# Altium schematic sheet Power_Circuitry.SchDoc
size A4; SheetNumber: 7; SheetTotal: 7
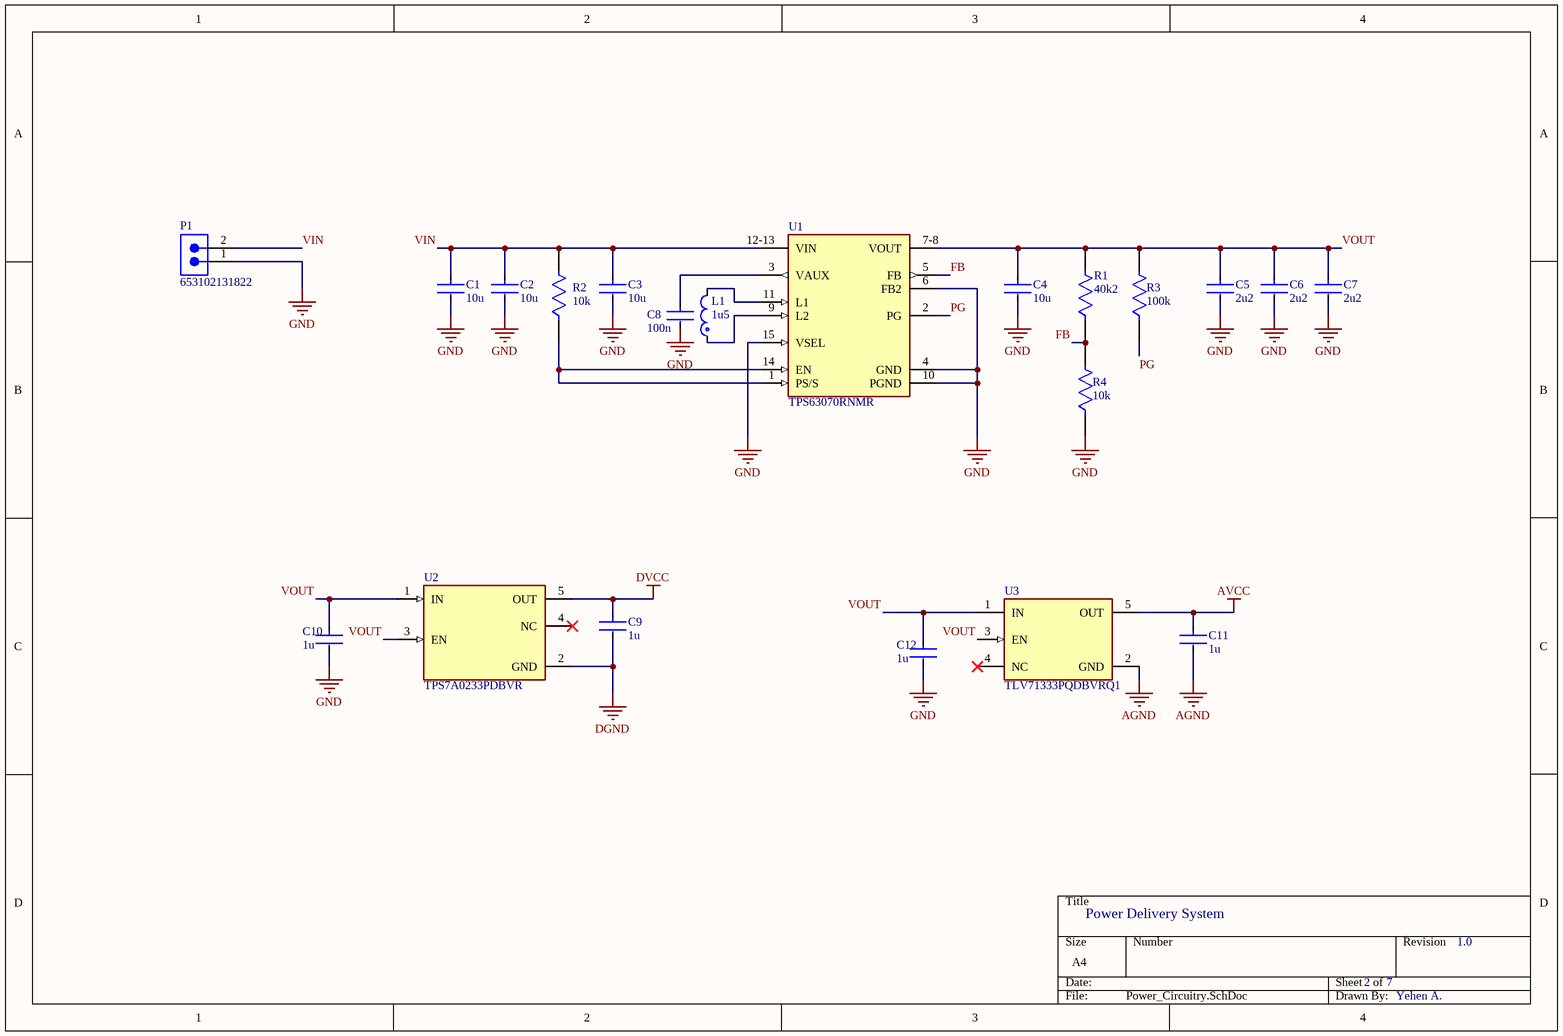
[diagram p0: Power_Circuitry.SchDoc]

## Parts
C1  10u  [FP-GRM21B-0_2-e0_2_0_7-IPC_C]
C2  10u  [FP-GRM21B-0_2-e0_2_0_7-IPC_C]
C3  10u  [FP-GRM21B-0_2-e0_2_0_7-IPC_C]
C4  10u  [FP-GRM21B-0_2-e0_2_0_7-IPC_C]
C5  2u2  [FP-GRM21B-0_2-e0_2_0_7-IPC_B]
C6  2u2  [FP-GRM21B-0_2-e0_2_0_7-IPC_B]
C7  2u2  [FP-GRM21B-0_2-e0_2_0_7-IPC_B]
C8  100n  [FP-GRM155-0_05-MFG]
C9  1u  [FP-0603-L_1_6_0_15-W_0_81-IPC_C]
C10  1u  [FP-0603-L_1_6_0_15-W_0_81-IPC_C]
C11  1u  [FP-0603-L_1_6_0_15-W_0_81-IPC_C]
C12  1u  [FP-0603-L_1_6_0_15-W_0_81-IPC_C]
L1  1u5  [FP-XFL4020-MFG]
P1  653102131822  [653102131822]
R1  40k2  [FP-RN732A-MFG]
R2  10k  [FP-CRGCQ0805-IPC_C]
R3  100k  [FP-RN732A-MFG]
R4  10k  [FP-RN732A-MFG]
U1  TPS63070RNMR  [FP-RNM0015A-MFG]
U2  TPS7A0233PDBVR  [FP-DBV0005A-IPC_B]
U3  TLV71333PQDBVRQ1  [FP-DBV0005A-IPC_C]

## Nets
AGND: C11.2 U3.2(GND)
AVCC: C11.1 U3.5(OUT)
DGND: C9.2 U2.2(GND)
DVCC: C9.1 U2.5(OUT)
GND: C1.2 C2.2 C3.2 C4.2 C5.2 C6.2 C7.2 C8.2 C10.2 C12.2 P1.1 R4.1 U1.4(GND) U1.6(FB2) U1.10(PGND) U1.15(VSEL)
FB: R1.1 R4.2 U1.5(FB)
PG: R3.1 U1.2(PG)
VIN: C1.1 C2.1 C3.1 P1.2 R2.2 U1.12-13(VIN)
VOUT: C4.1 C5.1 C6.1 C7.1 C10.1 C12.1 R1.2 R3.2 U1.7-8(VOUT) U2.1(IN) U2.3(EN) U3.1(IN) U3.3(EN)
NetC8_1: C8.1 U1.3(VAUX)
NetL1_1: L1.1 U1.9(L2)
NetL1_2: L1.2 U1.11(L1)
NetR2_1: R2.1 U1.1(PS/S) U1.14(EN)

Not connected (* = marked no-connect by the designer): U2 4(NC)*; U3 4(NC)*

## Notes on the sheet
- Power Delivery System
- 2
- 7
- 1.0
- Yehen A.

## Library data of the parts
C1-C4 = CMP-06035-056773-1: Chip Multilayer Ceramic Capacitors for General Purpose, 0805, 10uF, X7S, 22%, 20%, 25V; Case/Package: 0805; Min Operating Temperature: -55°C; Packaging: Tape and Reel; Height: 1.25mm; Thickness: 0.057inch; Weight: 0.000335oz; Termination: SMD/SMT; Capacitance: 10uF; Max Operating Temperature: 125°C; Length: 0.079inch; Dielectric: X7S; Mount: Surface Mount; Voltage Rating (DC): 25V; Case Code (Imperial): 0805; Case Code (Metric): 2012; Voltage Rating: 25V; Tolerance: 20%; Package Quantity: 3000; Width: 0.049inch
C5-C7 = CMP-06035-063309-1: CAP CER 2.2UF 100V X7T 0805
C8 = CMP-06035-040303-1: Chip Multilayer Ceramic Capacitors for General Purpose, 0402, 0.10uF, B, 10%, 20%, 50V
C9-C12 = CMP-2006-04474-2: General Purpose Ceramic Capacitor, 0603, 1uF, 10%, X5R, 15%, 6.3V; Insulation Resistance: 100GR; Dissipation Factor: 5%; Package Quantity: 1; Mount: Surface Mount; Series: -; Number of Pins: 2; Length: 1.6mm; RoHS Compliant: Yes; Capacitance: 1uF; Depth: 0.81mm; Case Code (Imperial): 0603; Lead Free: Lead Free; Max Operating Temperature: 85°C; Case Code (Metric): 1608; Min Operating Temperature: -55°C; Contact Plating: Tin; Voltage: 6.3V; Tolerance: 10%; Width: 0.032inch; Voltage Rating (DC): 6.3V; Voltage Rating: 6.3V; Termination: SMD/SMT; Radiation Hardening: No; Case/Package: 0603; Thickness: 0.035inch; Height: 0.9mm; REACH SVHC: No SVHC; Packaging: Tape and Reel; Construction: Flat; Dielectric: X5R
L1 = CMP-11268-000104-1: Inductor Power Shielded Wirewound 1.5uH 20% 100KHz 9.1A 15.8mOhm DCR 1515 Automotive Embossed Plastic T/R; Core Material: Composite; DC Resistance (DCR): 15.8mR; Saturation Current: 4.1A; Self Resonant Frequency: 59MHz; Tolerance: 20%; Inductance: 1.5uH; Max DC Current: 9.1A; RoHS Compliant: Yes; Max Operating Temperature: 125°C; Length: 4.3mm; Case/Package: SMD/SMT; Mount: Surface Mount; Shielding: Shielded; Min Operating Temperature: -40°C; RMS Current (Irms): 9.1A; Test Frequency: 100kHz; Inductance Tolerance: 20%; REACH SVHC: No SVHC; Packaging: Tape and Reel; Termination: SMD/SMT; Lead Free: Contains Lead; Width: 4.3mm; Series: XFL4020; Height: 2.1mm
P1 = CMP-1502-00771-2: NexarPartId: 18818274; Number of Contacts: 2; Insulation Resistance: 100MΩ; Connector Type: Male Pin; Contact Resistance: 20mΩ; Voltage Rating: 125V; Current Rating: 1A; Gender: Male; Insulation: Insulated; Pitch: 1.25mm; Height: 4.2mm; Termination: SMD/SMT; Contact Material: Copper; Contact Plating: Tin; RoHS: Compliant; Number of Pins: 2; Length: 7.25mm; Housing Material: Nylon; Packaging: Tape and Reel; Lead Pitch: 1.25mm; Contact Mating Length: 2.1336mm; Mount: Surface Mount; Max Operating Temperature: 85°C; Contact Gender: Male; Number of Rows: 1; REACH SVHC: Unknown; Number of Positions: 2; Color: Beige, White; Operating Supply Voltage: 125V; Min Operating Temperature: -40°C; Width: 7.25mm; Flammability Rating: UL94 V-0
R1 = CMP-03211-001035-1: SMD Chip Resistor, Thin Film, 40.2KΩ, 100 V, 0805 [2012 Metric], 100 mW, 0.1%, RN73 Series; Manufacturer Part Number: RN73C2A40K2BTDF; Manufacturer: TE Connectivity; Voltage Rating: 100V; Power Rating: 0.1W; Temperature Coefficient: 10ppm/°C; Octopart: https://octopart.com/rn73c2a40k2btdf-te+connectivity-21411991; RoHS: TRUE; Package: RN732A; Series: RN73; Device Class L3: Chip SMD Resistors; Resistance: 40.2KΩ; packaging: 1000 Reel; Category: Res; Device Class L1: Passive Components; ComponentLink2Description: Datasheet; Value: 40.2KΩ; Temperature Range High: 155°C; Composition: Thin Film; ComponentLink2URL: https://www.te.com/commerce/DocumentDelivery/DDEController?Action=showdoc&DocId=Data+Sheet%7F1773270%7FP%7Fpdf%7FEnglish%7FENG_DS_1773270_P.pdf%7F1676162-2; Ipc Land Pattern Name: RESC200125X55; Temperature Range Low: -55°C; Tolerance: 0.1%; Lead Free: Yes; Temperature: -55°C to 155°C; Device Class L2: Resistors; octopart_url: https://octopart.com/rn73c2a40k2btdf-te+connectivity-21411991; Height: 0.65mm; Automotive: No
R2 = CMP-03211-002989-1: CRGCQ 0805 10K 5%; Manufacturer Part Number: CRGCQ0805J10K; Manufacturer: TE Connectivity; Voltage Rating: 150V; Temperature Coefficient: ±100ppm/°C; Resistance: 10KΩ; Value: 10KΩ; Power Rating: 0.125W; Tolerance: 0.05; Automotive Grade: Grade 914; Height: 0.65mm; Lead Free: Yes; Temperature Range High: +155°C; Composition: Thick Film; Temperature Range Low: -55°C; Ambient Temperature Range High: +70°C; Temperature: -55°C to +155°C; Package: CRGCQ0805; Device Class L2: Resistors; RoHS: TRUE; ComponentLink2URL: https://www.te.com/commerce/DocumentDelivery/DDEController?Action=showdoc&DocId=Data+Sheet%7F1773204-3%7F1%7Fpdf%7FEnglish%7FENG_DS_1773204-3_1.pdf%7F4-2176341-923; Series: CRGCQ; Device Class L1: Passive Components; Ipc Land Pattern Name: RESC200125X55; ComponentLink2Description: Datasheet; Category: Res; Digikey Description: CRGCQ 0805 10K 5%; Mouser Description: Res Thick Film 0805 10K Ohm 5% 0.125W(1/8W) ±100ppm/C Pad SMD Automotive T/R; Automotive: Yes; Octopart: https://octopart.com/crgcq0805j10k-te+connectivity-91018201; Device Class L3: Chip SMD Resistors
R3 = CMP-03211-001008-1: SMD Chip Resistor, Thin Film, 100KΩ, 100 V, 0805 [2012 Metric], 100 mW, 0.1%, RN73 Series; Manufacturer Part Number: RN73C2A100KB; Manufacturer: TE Connectivity; Temperature Coefficient: 10ppm/°C; Voltage Rating: 100V; Power Rating: 0.1W; RoHS: TRUE; Resistance: 100KΩ; Category: Res; packaging: Custom; Lead Free: Yes; Ipc Land Pattern Name: RESC200125X55; Device Class L1: Passive Components; Temperature: -55°C to 155°C; Composition: Thin Film; ComponentLink2URL: https://www.te.com/commerce/DocumentDelivery/DDEController?Action=showdoc&DocId=Data+Sheet%7F1773270%7FP%7Fpdf%7FEnglish%7FENG_DS_1773270_P.pdf%7F1676162-2; Value: 100KΩ; Device Class L2: Resistors; Series: RN73; Package: RN732A; octopart_url: https://octopart.com/rn73c2a100kb-te+connectivity-16078029; Automotive: No; Device Class L3: Chip SMD Resistors; Octopart: https://octopart.com/rn73c2a100kb-te+connectivity-16078029; Temperature Range Low: -55°C; Tolerance: 0.1%; Temperature Range High: 155°C; ComponentLink2Description: Datasheet; Height: 0.65mm
R4 = CMP-03211-001029-1: SMD Chip Resistor, Thin Film, 10KΩ, 100 V, 0805 [2012 Metric], 100 mW, 0.1%, RN73 Series; Manufacturer Part Number: RN73C2A10KBTG; Manufacturer: TE Connectivity; Temperature Coefficient: 10ppm/°C; Voltage Rating: 100V; Power Rating: 0.1W; Value: 10KΩ; Composition: Thin Film; Package: RN732A; Device Class L2: Resistors; Device Class L1: Passive Components; ComponentLink2Description: Datasheet; Category: Res; Lead Free: Yes; Height: 0.65mm; packaging: 250 cut tape length; Temperature Range High: 155°C; Temperature: -55°C to 155°C; Tolerance: 0.1%; Octopart: https://octopart.com/rn73c2a10kbtg-te+connectivity-21411919; Temperature Range Low: -55°C; Device Class L3: Chip SMD Resistors; Resistance: 10KΩ; Series: RN73; RoHS: TRUE; ComponentLink2URL: https://www.te.com/commerce/DocumentDelivery/DDEController?Action=showdoc&DocId=Data+Sheet%7F1773270%7FP%7Fpdf%7FEnglish%7FENG_DS_1773270_P.pdf%7F1676162-2; Ipc Land Pattern Name: RESC200125X55; Automotive: No; octopart_url: https://octopart.com/rn73c2a10kbtg-te+connectivity-21411919
U1 = CMP-04918-000409-1: IC REG BCK BST ADJ 3.6A 15VQFN; Synchronous Rectifier: Yes; Output Type: Adjustable; Output Current: 2A; Max Input Voltage: 16V; Switching Frequency: 2.4MHz; Min Output Voltage: 2.5V; Output Configuration: Positive; Min Input Voltage: 2V; Topology: Buck-Boost; Number of Outputs: 1; Max Output Voltage: 9V; Quiescent Current: 50uA; Max Operating Temperature: 125°C; Case/Package: VQFN; Number of Pins: 15; RoHS Compliant: Yes; Mount: Surface Mount; Min Operating Temperature: -40°C; Lead Free: Lead Free; Packaging: Tape and Reel
U2 = CMP-04917-000286-1: IC REG LINEAR 3.3V 200MA SOT23-5; RoHS Compliant: Yes
U3 = CMP-04917-000151-1: IC REG LINEAR 3.3V 150MA SOT23-5; Number of Regulators: 1; Min Current Limit: 175mA; Dropout Voltage: 230mV; Quiescent Current: 50uA; Lead Free: Lead Free; RoHS Compliant: Yes; Packaging: Tape and Reel; Max Operating Temperature: 125°C; Mount: Surface Mount; Case/Package: SOT-23-5; Min Operating Temperature: -40°C; Output Current: 150mA; Output Voltage: 3.3V